# EAGLE design THAT340_FET (EAGLE 9.3.1)
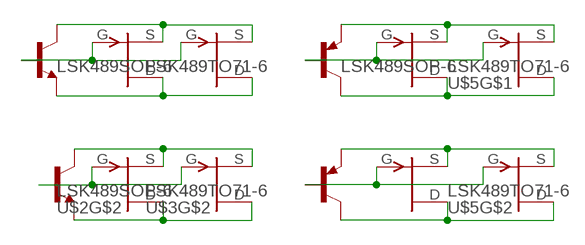
[diagram p0: schematic, sheet 1]

## Parts
U$1  TRANSISTOR-ARRAYS_THAT340  [TRANSISTOR-ARRAYS_DIP254P762X510-14]
U$2  LSK489SOP-6  [SOT-23-6]
U$3  LSK489TO71-6  [TO71-6]
U$4  LSK489SOP-6  [SOT-23-6]
U$5  LSK489TO71-6  [TO71-6]

## Nets
N$1: U$1.10(E) U$4.6(S) U$5.5(S)
N$2: U$1.8(C) U$4.5(D) U$5.6(D)
N$3: U$1.9(B) U$4.4(G) U$5.7(G)
N$4: U$1.7(C) U$4.2(D) U$5.2(D)
N$5: U$1.5(E) U$4.3(S) U$5.1(S)
N$6: U$1.6(B) U$4.1(G) U$5.3(G)
N$7: U$1.1(C) U$2.3(S) U$3.1(S)
N$8: U$1.3(E) U$2.2(D) U$3.2(D)
N$9: U$1.2(B) U$2.1(G) U$3.3(G)
N$10: U$1.13(B) U$2.4(G) U$3.7(G)
N$11: U$1.14(C) U$2.6(S) U$3.5(S)
N$12: U$1.12(E) U$2.5(D) U$3.6(D)

## Library data of the parts
U$1 = Vwvwbg:TRANSISTOR-ARRAYS_THAT340
U$2-U$5 = Vwvwbg:LSK489

## Board
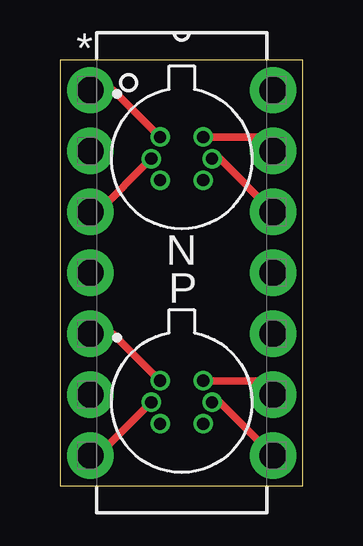
[diagram p1: board, top side]
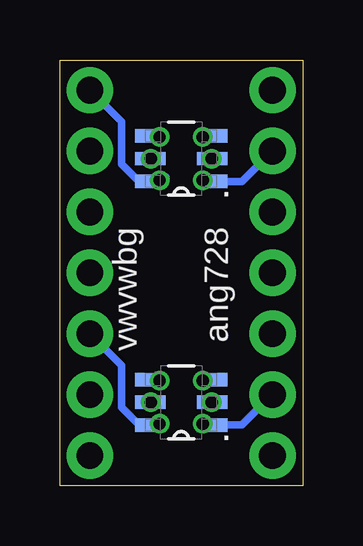
[diagram p2: board, bottom side, seen from below]

Size 10.14 x 17.77 mm. Coordinates in mm from the lower left corner, seen from the top.
Outline: 0,0 10.14,0 10.14,17.77 0,17.77 0,0
Copper layers (1*16): Top 0.035mm / dielectric 1.5mm / Bottom 0.035mm
Design rules "default *": minimum track width 10mil, minimum drill 24mil, track to track 8mil, track to pad 8mil, pad to pad 8mil, via to via 8mil, smd to smd 8mil, copper to edge 8mil, drill to drill 8mil, minimum pad ring 0mil, minimum via ring 8mil, stop-mask expansion 4mil, vias tented up to drill 0mil, thermal gap 10mil

### Footprints (pad centres in the part's own frame; a part is rotated, then mirrored left to right if it is on the bottom)
TRANSISTOR-ARRAYS_DIP254P762X510-14 = drill 1.118 pad 1.93: 1 -7.62,15.24; 2 -7.62,12.7; 3 -7.62,10.16; 4 -7.62,7.62; 5 -7.62,5.08; 6 -7.62,2.54; 7 -7.62,0; 8 0,0; 9 0,2.54; 10 0,5.08; 11 0,7.62; 12 0,10.16; 13 0,12.7; 14 0,15.24
SOT-23-6 = smd 1.27 x 0.559: 1 -1.295,0.95; 2 -1.295,0; 3 -1.295,-0.95; 4 1.295,-0.95; 5 1.295,0; 6 1.295,0.95
TO71-6 = drill 0.508 pad 0.813: 1 -1.27,0; 2 -0.898,-0.898; 3 0,-1.27; 5 1.27,0; 6 0.898,0.898; 7 0,1.27

### Placement (x,y rotation side)
U$1  8.89,1.27 0 top
U$2  5.08,13.65 180 bottom
U$3  5.08,13.65 315 top
U$4  5.08,3.49 180 bottom
U$5  5.08,3.49 315 top

### Tracks (layer width: path | path; a pad name or v marks a point on that pad's centre or on a via)
N$1
  Bottom 0.305: U$4.6 6.38,2.56 | U$1.10 7.57,5.03 7.57,3.27 6.84,2.54 U$4.6 | U$4.6 6.03,2.54 U$5.5
N$2
  Top 0.305: U$5.6 6.67,3.49 U$1.8
  Bottom 0.305: U$4.5 U$5.6
N$3
  Top 0.305: U$5.7 8.31,4.39 U$1.9
  Bottom 0.305: U$4.4 6.32,4.39 U$5.7
N$4
  Top 0.305: U$5.2 1.59,1.27 U$1.7
  Bottom 0.305: U$4.2 U$5.2
N$5
  Top 0.305: U$1.5 2.22,6.35 U$5.1
  Bottom 0.305: U$4.3 3.84,4.39 U$5.1
N$6
  Bottom 0.305: U$1.6 2.54,2.54 U$4.1 4.13,2.54 U$5.3
N$7
  Top 0.305: U$1.1 2.22,16.51 U$3.1
  Bottom 0.305: U$2.3 3.84,14.55 U$3.1
N$8
  Top 0.305: U$3.2 1.59,11.43 U$1.3
  Bottom 0.305: U$2.2 U$3.2
N$9
  Bottom 0.305: U$1.2 2.54,12.7 U$2.1 4.13,12.7 U$3.3
N$10
  Top 0.305: U$1.13 8.31,14.55 U$3.7
  Bottom 0.305: U$2.4 6.32,14.55 U$3.7
N$11
  Bottom 0.305: U$2.6 6.19,12.89 5.72,12.89 | U$1.14 7.57,15.19 7.57,13.43 6.84,12.7 U$2.6 | U$2.6 6.03,12.7 U$3.5
N$12
  Top 0.305: U$1.12 6.67,13.65 U$3.6
  Bottom 0.305: U$2.5 U$3.6

### Text on the board
tPlace: N | P
bPlace: ang728 | vwvwbg